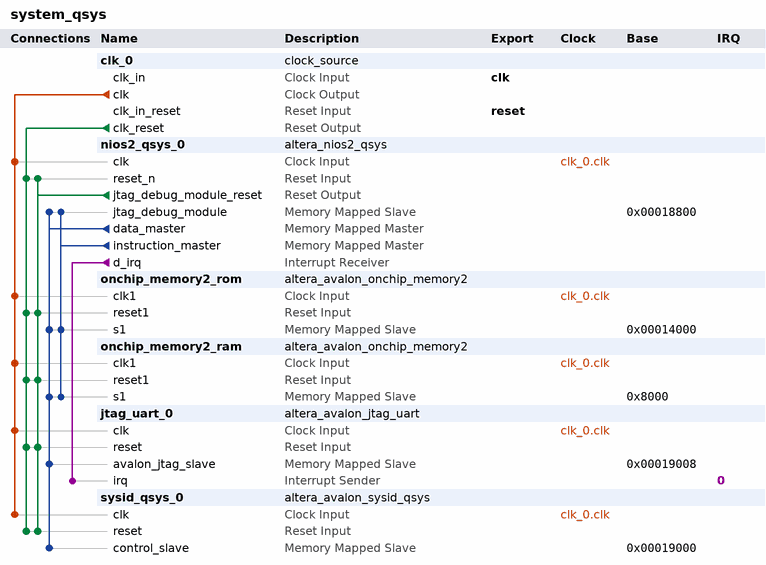
[diagram p0: system contents]
# Platform Designer (Qsys) system system_qsys, Cyclone IV E EP4CE115F29C8
# Parameters at their usual value, and those the tool derives, are not listed.
package require -exact qsys 13.1
create_system system_qsys
set_project_property DEVICE_FAMILY {Cyclone IV E}
set_project_property DEVICE EP4CE115F29C8

add_instance clk_0 clock_source 13.1
set_instance_parameter_value clk_0 clockFrequency 50000000

add_instance nios2_qsys_0 altera_nios2_qsys 13.1
set_instance_parameter_value nios2_qsys_0 muldiv_divider true
set_instance_parameter_value nios2_qsys_0 resetSlave onchip_memory2_rom.s1
set_instance_parameter_value nios2_qsys_0 mmu_TLBMissExcSlave None
set_instance_parameter_value nios2_qsys_0 exceptionSlave onchip_memory2_ram.s1
set_instance_parameter_value nios2_qsys_0 breakSlave nios2_qsys_0.jtag_debug_module
set_instance_parameter_value nios2_qsys_0 impl Fast
set_instance_parameter_value nios2_qsys_0 icache_size 4096

add_instance onchip_memory2_rom altera_avalon_onchip_memory2 13.1
set_instance_parameter_value onchip_memory2_rom dataWidth 32
set_instance_parameter_value onchip_memory2_rom dualPort false
set_instance_parameter_value onchip_memory2_rom initMemContent true
set_instance_parameter_value onchip_memory2_rom initializationFileName onchip_mem.hex
set_instance_parameter_value onchip_memory2_rom memorySize 10240
set_instance_parameter_value onchip_memory2_rom writable false

add_instance onchip_memory2_ram altera_avalon_onchip_memory2 13.1
set_instance_parameter_value onchip_memory2_ram dataWidth 32
set_instance_parameter_value onchip_memory2_ram dualPort false
set_instance_parameter_value onchip_memory2_ram initMemContent true
set_instance_parameter_value onchip_memory2_ram initializationFileName onchip_mem.hex
set_instance_parameter_value onchip_memory2_ram memorySize 20480

add_instance jtag_uart_0 altera_avalon_jtag_uart 13.1
set_instance_parameter_value jtag_uart_0 simInteractiveOptions NO_INTERACTIVE_WINDOWS

add_instance sysid_qsys_0 altera_avalon_sysid_qsys 13.1
set_instance_parameter_value sysid_qsys_0 id 0

# connections
add_connection clk_0.clk jtag_uart_0.clk clock
add_connection clk_0.clk nios2_qsys_0.clk clock
add_connection clk_0.clk onchip_memory2_ram.clk1 clock
add_connection clk_0.clk onchip_memory2_rom.clk1 clock
add_connection clk_0.clk sysid_qsys_0.clk clock
add_connection clk_0.clk_reset jtag_uart_0.reset reset
add_connection clk_0.clk_reset nios2_qsys_0.reset_n reset
add_connection clk_0.clk_reset onchip_memory2_ram.reset1 reset
add_connection clk_0.clk_reset onchip_memory2_rom.reset1 reset
add_connection clk_0.clk_reset sysid_qsys_0.reset reset
add_connection nios2_qsys_0.jtag_debug_module_reset jtag_uart_0.reset reset
add_connection nios2_qsys_0.jtag_debug_module_reset nios2_qsys_0.reset_n reset
add_connection nios2_qsys_0.jtag_debug_module_reset onchip_memory2_ram.reset1 reset
add_connection nios2_qsys_0.jtag_debug_module_reset onchip_memory2_rom.reset1 reset
add_connection nios2_qsys_0.jtag_debug_module_reset sysid_qsys_0.reset reset
add_connection nios2_qsys_0.data_master jtag_uart_0.avalon_jtag_slave avalon
set_connection_parameter_value nios2_qsys_0.data_master/jtag_uart_0.avalon_jtag_slave baseAddress 0x00019008
add_connection nios2_qsys_0.data_master nios2_qsys_0.jtag_debug_module avalon
set_connection_parameter_value nios2_qsys_0.data_master/nios2_qsys_0.jtag_debug_module baseAddress 0x00018800
add_connection nios2_qsys_0.data_master onchip_memory2_ram.s1 avalon
set_connection_parameter_value nios2_qsys_0.data_master/onchip_memory2_ram.s1 baseAddress 0x8000
add_connection nios2_qsys_0.data_master onchip_memory2_rom.s1 avalon
set_connection_parameter_value nios2_qsys_0.data_master/onchip_memory2_rom.s1 baseAddress 0x00014000
add_connection nios2_qsys_0.data_master sysid_qsys_0.control_slave avalon
set_connection_parameter_value nios2_qsys_0.data_master/sysid_qsys_0.control_slave baseAddress 0x00019000
add_connection nios2_qsys_0.instruction_master nios2_qsys_0.jtag_debug_module avalon
set_connection_parameter_value nios2_qsys_0.instruction_master/nios2_qsys_0.jtag_debug_module baseAddress 0x00018800
add_connection nios2_qsys_0.instruction_master onchip_memory2_ram.s1 avalon
set_connection_parameter_value nios2_qsys_0.instruction_master/onchip_memory2_ram.s1 baseAddress 0x8000
add_connection nios2_qsys_0.instruction_master onchip_memory2_rom.s1 avalon
set_connection_parameter_value nios2_qsys_0.instruction_master/onchip_memory2_rom.s1 baseAddress 0x00014000
add_connection nios2_qsys_0.d_irq jtag_uart_0.irq interrupt
set_connection_parameter_value nios2_qsys_0.d_irq/jtag_uart_0.irq irqNumber 0

# exported interfaces
add_interface clk clock sink
set_interface_property clk EXPORT_OF clk_0.clk_in
add_interface reset reset sink
set_interface_property reset EXPORT_OF clk_0.clk_in_reset

set_interconnect_requirement {$system} qsys_mm.clockCrossingAdapter HANDSHAKE
set_interconnect_requirement {$system} qsys_mm.maxAdditionalLatency 1
set_interconnect_requirement {$system} qsys_mm.insertDefaultSlave false

save_system system_qsys.qsys
